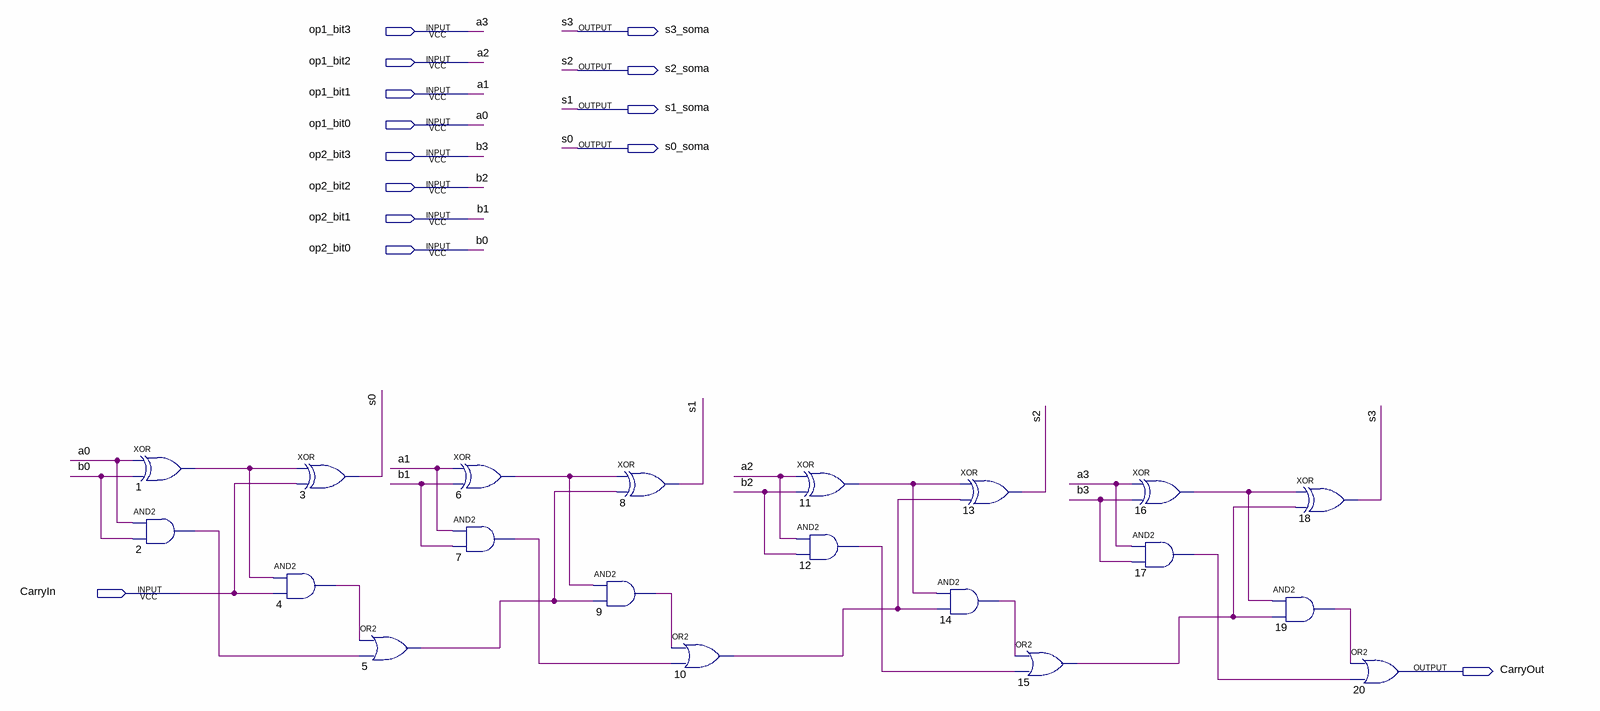
[diagram p0: schematic sheet]
// Quartus schematic soma4bits.bdf as structural Verilog: 20 symbols, 14 pins
module soma4bits (
  input  op1_bit3,
  input  op1_bit2,
  input  op1_bit1,
  input  op1_bit0,
  input  op2_bit3,
  input  op2_bit2,
  input  op2_bit1,
  input  op2_bit0,
  input  CarryIn,
  output s3_soma,
  output s2_soma,
  output s1_soma,
  output s0_soma,
  output CarryOut
);

  wire n1_out, n2_out, n4_out, n5_out, n6_out, n7_out, n9_out, n10_out, n11_out, n12_out, n14_out, n15_out,
       n16_out, n17_out, n19_out;

  xor u_1 (n1_out, op1_bit0, op2_bit0);
  and u_2 (n2_out, op1_bit0, op2_bit0);
  xor u_3 (s0_soma, n1_out, CarryIn);
  and u_4 (n4_out, n1_out, CarryIn);
  or u_5 (n5_out, n4_out, n2_out);
  xor u_6 (n6_out, op1_bit1, op2_bit1);
  and u_7 (n7_out, op1_bit1, op2_bit1);
  xor u_8 (s1_soma, n6_out, n5_out);
  and u_9 (n9_out, n6_out, n5_out);
  or u_10 (n10_out, n9_out, n7_out);
  xor u_11 (n11_out, op1_bit2, op2_bit2);
  and u_12 (n12_out, op1_bit2, op2_bit2);
  and u_14 (n14_out, n11_out, n10_out);
  xor u_13 (s2_soma, n11_out, n10_out);
  or u_15 (n15_out, n14_out, n12_out);
  xor u_16 (n16_out, op1_bit3, op2_bit3);
  and u_17 (n17_out, op1_bit3, op2_bit3);
  xor u_18 (s3_soma, n16_out, n15_out);
  and u_19 (n19_out, n16_out, n15_out);
  or u_20 (CarryOut, n19_out, n17_out);

  // Other names for the same wires on the sheet: a0 = op1_bit0; a1 = op1_bit1; a2 = op1_bit2; a3 = op1_bit3;
  //   b0 = op2_bit0; b1 = op2_bit1; b2 = op2_bit2; b3 = op2_bit3; s0 = s0_soma; s1 = s1_soma; s2 = s2_soma;
  //   s3 = s3_soma
endmodule
